# Altium schematic sheet DRV驱动.SchDoc
size A3; SheetNumber: 1; SheetTotal: 1
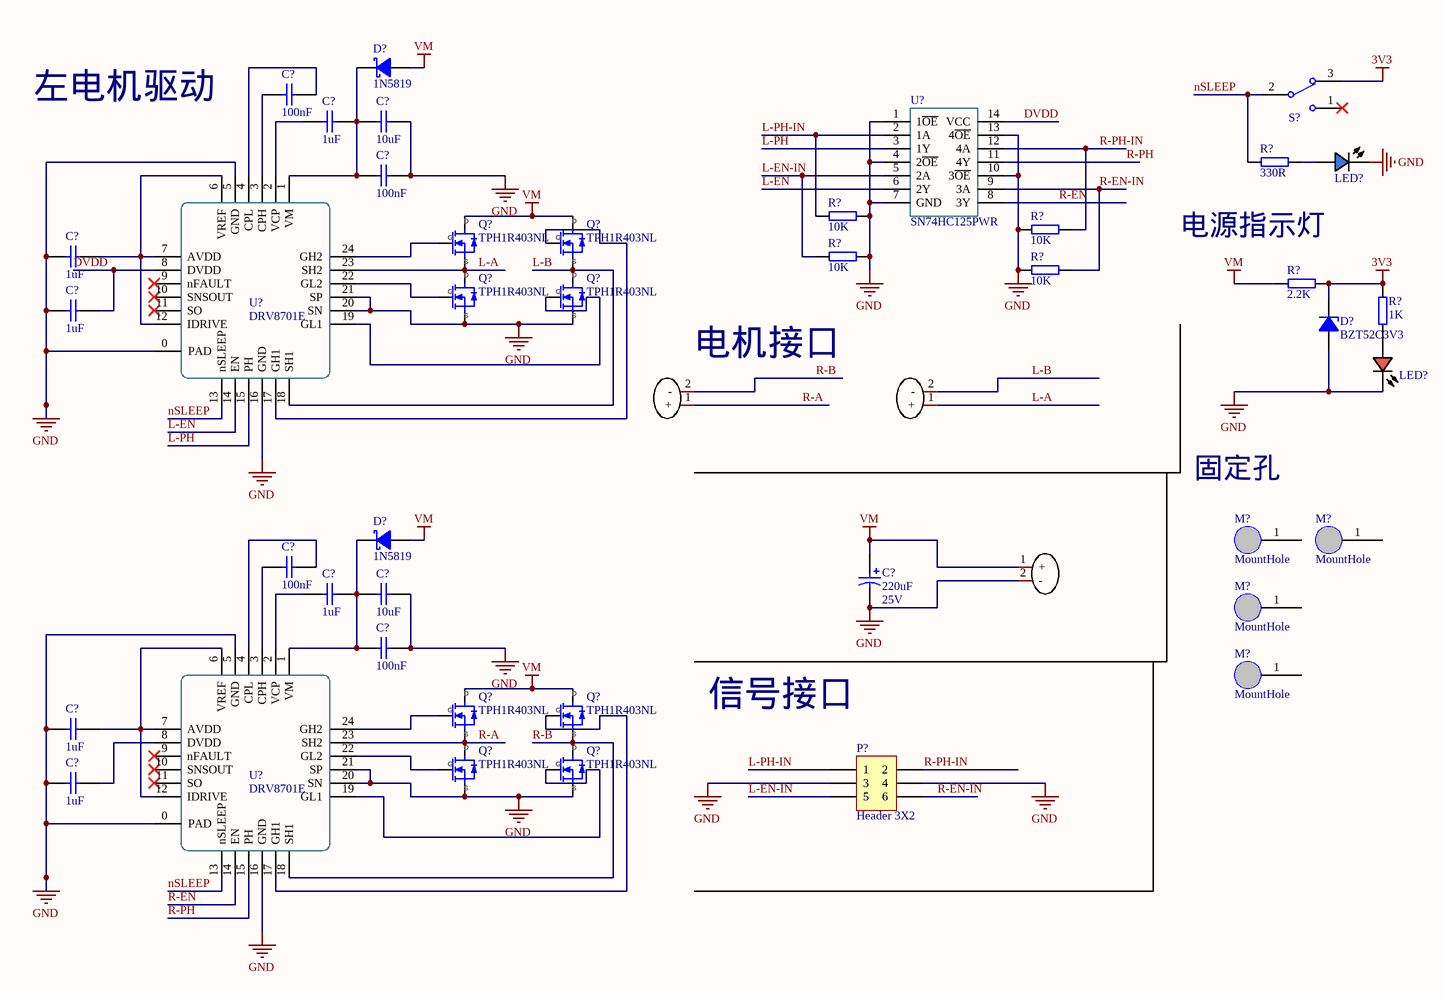
[diagram p0: DRV驱动.SchDoc]

## Parts
(Parts that share a designator on the sheet are numbered #1, #2 ... from top to bottom, then left to right.)
C?#1  value 100nF  [CAPC1608[0603]S-N]  (hidden comment: 100nF ±10% 50V)
C?#2  value 1uF  [CAPC1608[0603]S-N]  (hidden comment: 1uF ±10% 25V)
C?#3  value 10uF  [CAPC2012[0805]S-N]  (hidden comment: 10uF ±10% 25V)
C?#4  value 100nF  [CAPC1608[0603]S-N]  (hidden comment: 100nF ±10% 50V)
C?#5  value 1uF  [CAPC1608[0603]S-N]  (hidden comment: 1uF ±10% 25V)
C?#6  value 1uF  [CAPC1608[0603]S-N]  (hidden comment: 1uF ±10% 25V)
C?#7  value 220uF  Voltage: 25V  [CAPPR3.5-8X11.5]  (hidden comment: 220uF 25V)
C?#8  value 100nF  [CAPC1608[0603]S-N]  (hidden comment: 100nF ±10% 50V)
C?#9  value 1uF  [CAPC1608[0603]S-N]  (hidden comment: 1uF ±10% 25V)
C?#10  value 10uF  [CAPC2012[0805]S-N]  (hidden comment: 10uF ±10% 25V)
C?#11  value 100nF  [CAPC1608[0603]S-N]  (hidden comment: 100nF ±10% 50V)
C?#12  value 1uF  [CAPC1608[0603]S-N]  (hidden comment: 1uF ±10% 25V)
C?#13  value 1uF  [CAPC1608[0603]S-N]  (hidden comment: 1uF ±10% 25V)
CN?#1  XT30UPB-F30.G.Y  [CONN-TH_XT30UPB-M]  (value not drawn)
CN?#2  XT30UPB-F30.G.Y  [CONN-TH_XT30UPB-M]  (value not drawn)
CN?#3  XT30UPB-F30.G.Y  [CONN-TH_XT30UPB-M]  (value not drawn)
D?#1  1N5819  [SOD-123-L]
D?#2  BZT52C3V3  [SOD-123-L]
D?#3  1N5819  [SOD-123-L]
LED?#1  Blue  [LEDC1608(0603)]  (value not drawn)
LED?#2  (no value)  [LEDC1608(0603)]
M?#1  MountHole  [M3-MountSlot]  (no BOM)
M?#2  MountHole  [M3-MountSlot]  (no BOM)
M?#3  MountHole  [M3-MountSlot]  (no BOM)
M?#4  MountHole  [M3-MountSlot]  (no BOM)
P?  Header 3X2  [HDR2X3]
Q?#1  TPH1R403NL  [DFN5x6]
Q?#2  TPH1R403NL  [DFN5x6]
Q?#3  TPH1R403NL  [DFN5x6]
Q?#4  TPH1R403NL  [DFN5x6]
Q?#5  TPH1R403NL  [DFN5x6]
Q?#6  TPH1R403NL  [DFN5x6]
Q?#7  TPH1R403NL  [DFN5x6]
Q?#8  TPH1R403NL  [DFN5x6]
R?#1  value 330R  [RESC1608[0603]S-N]  (hidden comment: 330R ±1%)
R?#2  value 10K  [RESC1608[0603]S-N]  (hidden comment: 10K ±1%)
R?#3  value 10K  [RESC1608[0603]S-N]  (hidden comment: 10K ±1%)
R?#4  value 10K  [RESC1608[0603]S-N]  (hidden comment: 10K ±1%)
R?#5  value 10K  [RESC1608[0603]S-N]  (hidden comment: 10K ±1%)
R?#6  value 2.2K  [RESC1608[0603]S-N]  (hidden comment: 2.2K ±1%)
R?#7  value 1K  [RESC1608[0603]S-N]  (hidden comment: 1K ±1%)
S?  SW-SPDT  [SS12D10]  (value not drawn)
U?#1  SN74HC125PWR  [TSSOP-14]
U?#2  DRV8701E  [QFN24-4x4]
U?#3  DRV8701E  [QFN24-4x4]

## Nets
3V3: D?#2.K R?#6.2 R?#7.2 S?.3
GND: C?#3.2 C?#4.2 C?#5.1 C?#6.1 C?#7.2 C?#10.2 C?#11.2 C?#12.1 C?#13.1 CN?#3.2(-) D?#2.A LED?#1.C LED?#2.C P?.3 P?.4 Q?#3.3(S) Q?#4.3(S) Q?#7.3(S) Q?#8.3(S) R?#2.2 R?#3.1 R?#4.2 R?#5.1 U?#1.1(1~{OE}) U?#1.4(2~{OE}) U?#1.7(GND) U?#1.10(3~{OE}) U?#1.13(4~{OE}) U?#2.0(PAD) U?#2.5(GND) U?#2.16(GND) U?#2.20(SN) U?#2.21(SP) U?#3.0(PAD) U?#3.5(GND) U?#3.16(GND) U?#3.20(SN) U?#3.21(SP)
VM: C?#7.1 CN?#3.1(+) D?#1.A D?#3.A Q?#1.1(D) Q?#2.1(D) Q?#5.1(D) Q?#6.1(D) R?#6.1
DVDD: C?#6.2 U?#1.14(VCC) U?#2.8(DVDD)
L-A: CN?#2.1(+) Q?#1.3(S) Q?#3.1(D) U?#2.23(SH2)
L-B: CN?#2.2(-) Q?#2.3(S) Q?#4.1(D) U?#2.18(SH1)
L-EN: U?#1.6(2Y) U?#2.14(EN)
L-EN-IN: P?.5 R?#4.1 U?#1.5(2A)
L-PH: U?#1.3(1Y) U?#2.15(PH)
L-PH-IN: P?.1 R?#2.1 U?#1.2(1A)
nSLEEP: R?#1.1 S?.2 U?#2.13(nSLEEP) U?#3.13(nSLEEP)
R-A: CN?#1.1(+) Q?#5.3(S) Q?#7.1(D) U?#3.23(SH2)
R-B: CN?#1.2(-) Q?#6.3(S) Q?#8.1(D) U?#3.18(SH1)
R-EN: U?#1.8(3Y) U?#3.14(EN)
R-EN-IN: P?.6 R?#5.2 U?#1.9(3A)
R-PH: U?#1.11(4Y) U?#3.15(PH)
R-PH-IN: P?.2 R?#3.2 U?#1.12(4A)
NetC?#1_1: C?#1.1 U?#2.3(CPH)
NetC?#1_2: C?#1.2 U?#2.4(CPL)
NetC?#2_1: C?#2.1 U?#2.2(VCP)
NetC?#2_2: C?#2.2 C?#3.1 C?#4.1 D?#1.K U?#2.1(VM)
NetC?#5_2: C?#5.2 U?#2.6(VREF) U?#2.7(AVDD) U?#2.12(IDRIVE)
NetC?#8_1: C?#8.1 U?#3.3(CPH)
NetC?#8_2: C?#8.2 U?#3.4(CPL)
NetC?#9_1: C?#9.1 U?#3.2(VCP)
NetC?#9_2: C?#9.2 C?#10.1 C?#11.1 D?#3.K U?#3.1(VM)
NetC?#12_2: C?#12.2 U?#3.6(VREF) U?#3.7(AVDD) U?#3.12(IDRIVE)
NetC?#13_2: C?#13.2 U?#3.8(DVDD)
NetLED?#1_A: LED?#1.A R?#1.2
NetLED?#2_A: LED?#2.A R?#7.1
NetQ?#1_2: Q?#1.2(G) U?#2.24(GH2)
NetQ?#2_2: Q?#2.2(G) U?#2.17(GH1)
NetQ?#3_2: Q?#3.2(G) U?#2.22(GL2)
NetQ?#4_2: Q?#4.2(G) U?#2.19(GL1)
NetQ?#5_2: Q?#5.2(G) U?#3.24(GH2)
NetQ?#6_2: Q?#6.2(G) U?#3.17(GH1)
NetQ?#7_2: Q?#7.2(G) U?#3.22(GL2)
NetQ?#8_2: Q?#8.2(G) U?#3.19(GL1)

Not connected (* = marked no-connect by the designer): M?#1 1; M?#2 1; M?#3 1; M?#4 1; S? 1*; U?#2 9(nFAULT)* 10(SNSOUT)* 11(SO)*; U?#3 9(nFAULT)* 10(SNSOUT)* 11(SO)*

## Notes on the sheet
- 左电机驱动
- (near R?#1) 电源指示灯
- (near CN?#1) 电机接口
- 固定孔
- 信号接口

## Library data of the parts
C?#1 C?#4 C?#8 C?#11 = Cap-Chip_1: 贴片电容; Published: 8-Jun-2000; Revision: July-2002: Re-released for DXP Platform.; Publisher: Altium Limited; Price(RMB): 0.000; Voltage: 50V; Tolerance: ±10%
C?#2 C?#5 C?#6 C?#9 C?#12 C?#13 = Cap-Chip_2: 贴片电容; Published: 8-Jun-2000; Revision: July-2002: Re-released for DXP Platform.; Publisher: Altium Limited; Price(RMB): 0.000; Voltage: 25V; Tolerance: ±10%
C?#3 C?#10 = Cap-Chip: 贴片电容; Published: 8-Jun-2000; Revision: July-2002: Re-released for DXP Platform.; Publisher: Altium Limited; Price(RMB): 0.000; Voltage: 25V; Tolerance: ±10%
C?#7 = Cap-Elect: Polarized Capacitor (Radial); Published: 8-Jun-2000; Revision: July-2002: Re-released for DXP Platform.; Publisher: Altium Limited; Price(RMB): 0.000
CN?#1 CN?#2 = XT30UPB-F30.G.Y: Manufacturer: AMASS(艾迈斯); Add into BOM: yes; Brand: 艾迈斯; RatedVoltage: DC 500V; InterfaceType: 母头; MetalMaterial: 镀金; InsulationMaterial: PA; RatedCurrent: 15A; contact resistance: 0.65mΩ; Symbol: XT30UPB-F; Device: XT30UPB-F30.G.Y; LCSC Part Name: AMASS(艾迈斯)直立焊板式连接器XT30UPB30-F.G.*; Supplier Part: C108769; Manufacturer Part: XT30UPB-F30.G.Y; Supplier Footprint: -; JLCPCB Part Class: Extended Part; Datasheet: https://atta.szlcsc.com/upload/public/pdf/source/20220715/AFD68B9E8B6CA95A7295DBF4AF9325E4.pdf; Supplier: LCSC; Convert to PCB: yes; Model: XT30UPB-F30.G.Y; Power: -; Output: -; Input: -; Size: -; Interface: -; Type: 航模插头; Colour: 黄色; MaximumCurrent: -; Type1: -; NumberOfUSBHoles: -; RecommendedWireGauge: -; FlameRetardantGrade: -; Belt length: -; specifications: -
CN?#3 = XT30UPB-F30.G.Y: pin to pad: 1>2 2>1; Manufacturer: AMASS(艾迈斯); Add into BOM: yes; Brand: 艾迈斯; RatedVoltage: DC 500V; InterfaceType: 母头; MetalMaterial: 镀金; InsulationMaterial: PA; RatedCurrent: 15A; contact resistance: 0.65mΩ; Symbol: XT30UPB-F; Device: XT30UPB-F30.G.Y; LCSC Part Name: AMASS(艾迈斯)直立焊板式连接器XT30UPB30-F.G.*; Supplier Part: C108769; Manufacturer Part: XT30UPB-F30.G.Y; Supplier Footprint: -; JLCPCB Part Class: Extended Part; Datasheet: https://atta.szlcsc.com/upload/public/pdf/source/20220715/AFD68B9E8B6CA95A7295DBF4AF9325E4.pdf; Supplier: LCSC; Convert to PCB: yes; Model: XT30UPB-F30.G.Y; Power: -; Output: -; Input: -; Size: -; Interface: -; Type: 航模插头; Colour: 黄色; MaximumCurrent: -; Type1: -; NumberOfUSBHoles: -; RecommendedWireGauge: -; FlameRetardantGrade: -; Belt length: -; specifications: -
D?#1 D?#3 = Diode Schottky: 肖特基二极管 Diode; Imax: 500mA; Published: 8-Jun-2000; Revision: July-2002: Re-released for DXP Platform.; Publisher: Altium Limited; Price(RMB): 0.000; PartNumber: 1N5819
D?#2 = Diode Zen: 3.3V稳压二极管 SOD-123; Published: 8-Jun-2000; Revision: July-2002: Re-released for DXP Platform.; Publisher: Altium Limited; Price(RMB): 0.000
LED?#1 = LED Chip Blue: Typical Chip LED; Published: 8-Jun-2000; Revision: July-2002: Re-released for DXP Platform.; Publisher: Altium Limited; Price(RMB): 0.00; Color: Blue
LED?#2 = LED Chip Red: Typical Chip LED; Published: 8-Jun-2000; Revision: July-2002: Re-released for DXP Platform.; Publisher: Altium Limited; Price(RMB): 0.00
M?#1-M?#4 = MountHole: 固定孔
P? = Header 3X2: Header, 3-Pin, Dual row; LatestRevisionDate: 17-Jul-2002; LatestRevisionNote: Re-released for DXP Platform.; Publisher: Altium Limited; Price(RMB): 0.00
Q?#1-Q?#8 = TPH1R403NL: 东芝 N沟 MOS
R?#1 = Res-Chip_3: 贴片电阻; Published: 8-Jun-2000; Revision: July-2002: Re-released for DXP Platform.; Publisher: Altium Limited; Price(RMB): 0.000; Tolerance: ±1%
R?#2-R?#5 = Res-Chip_1: 贴片电阻; Published: 8-Jun-2000; Revision: July-2002: Re-released for DXP Platform.; Publisher: Altium Limited; Price(RMB): 0.000; Tolerance: ±1%
R?#6 = Res-Chip: 贴片电阻; Published: 8-Jun-2000; Revision: July-2002: Re-released for DXP Platform.; Publisher: Altium Limited; Price(RMB): 0.000; Tolerance: ±1%
R?#7 = Res-Chip_2: 贴片电阻; Published: 8-Jun-2000; Revision: July-2002: Re-released for DXP Platform.; Publisher: Altium Limited; Price(RMB): 0.000; Tolerance: ±1%
S? = SW-SPDT: 单刀双掷开关 3脚船型、钮子、拨动开关 SPDT Subminiature Toggle Switch; Published: 24-Mar-1999; Publisher: Altium Limited; Price(RMB): 0.000
U?#1 = SN74HC125PWR: 三态输出的四路缓冲器 TSSOP-20
U?#2 U?#3 = DRV8701E: DRV8701E Ti全桥驱动芯片